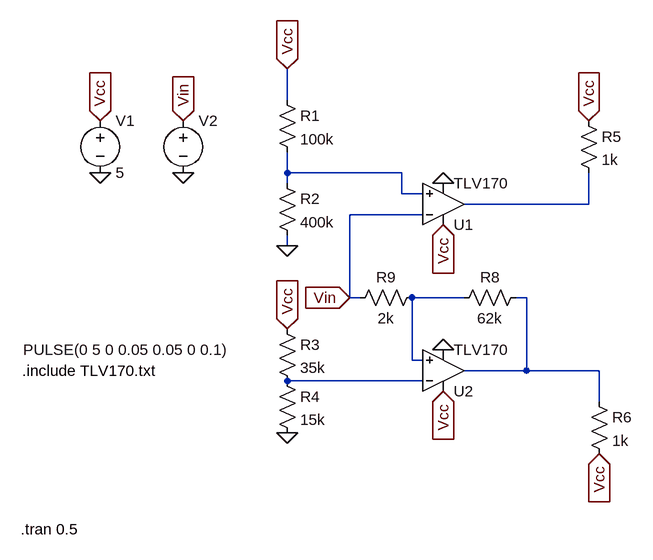
[diagram p0: schematic Draft9.asc]
Draft9.asc, the LTspice schematic file:
Version 4
SHEET 1 880 680
WIRE -96 -32 -96 -80
WIRE -96 80 -96 48
WIRE 80 80 -96 80
WIRE -96 96 -96 80
WIRE 80 112 80 80
WIRE 112 112 80 112
WIRE 368 128 368 80
WIRE 368 128 176 128
WIRE 112 144 0 144
WIRE -96 192 -96 176
WIRE 0 272 0 144
WIRE 16 272 0 272
WIRE 176 272 96 272
WIRE 272 272 256 272
WIRE 96 368 96 272
WIRE 112 368 96 368
WIRE 272 384 272 272
WIRE 272 384 176 384
WIRE 384 384 272 384
WIRE 112 400 -96 400
WIRE 384 432 384 384
FLAG -96 480 0
FLAG -96 192 0
FLAG -96 -80 Vcc
IOPIN -96 -80 In
FLAG -96 320 Vcc
IOPIN -96 320 In
FLAG 384 512 Vcc
IOPIN 384 512 In
FLAG 368 0 Vcc
IOPIN 368 0 In
FLAG 144 160 Vcc
IOPIN 144 160 In
FLAG 144 416 Vcc
IOPIN 144 416 In
FLAG 144 96 0
FLAG 144 352 0
FLAG 0 272 Vin
IOPIN 0 272 In
FLAG -384 0 Vcc
IOPIN -384 0 In
FLAG -256 0 Vin
IOPIN -256 0 In
FLAG -384 80 0
FLAG -256 80 0
SYMBOL Opamps\\opamp2 144 192 M180
SYMATTR InstName U1
SYMATTR Value TLV170
SYMBOL Opamps\\opamp2 144 448 M180
SYMATTR InstName U2
SYMATTR Value TLV170
SYMBOL res -112 -48 R0
SYMATTR InstName R1
SYMATTR Value 100k
SYMBOL res -112 80 R0
SYMATTR InstName R2
SYMATTR Value 400k
SYMBOL res -112 304 R0
SYMATTR InstName R3
SYMATTR Value 35k
SYMBOL res -112 384 R0
SYMATTR InstName R4
SYMATTR Value 15k
SYMBOL res 352 -16 R0
SYMATTR InstName R5
SYMATTR Value 1k
SYMBOL res 368 416 R0
SYMATTR InstName R6
SYMATTR Value 1k
SYMBOL res 272 256 R90
WINDOW 0 0 56 VBottom 2
WINDOW 3 32 56 VTop 2
SYMATTR InstName R8
SYMATTR Value 62k
SYMBOL res 112 256 R90
WINDOW 0 0 56 VBottom 2
WINDOW 3 32 56 VTop 2
SYMATTR InstName R9
SYMATTR Value 2k
SYMBOL voltage -384 -16 R0
WINDOW 123 0 0 Left 2
WINDOW 39 0 0 Left 2
SYMATTR InstName V1
SYMATTR Value 5
SYMBOL voltage -256 -16 R0
WINDOW 3 -246 368 Left 2
WINDOW 123 0 0 Left 2
WINDOW 39 0 0 Left 2
SYMATTR InstName V2
SYMATTR Value PULSE(0 5 0 0.05 0.05 0 0.1)
TEXT -504 384 Left 2 !.include TLV170.txt
TEXT -506 628 Left 2 !.tran 0.5

The netlist it stands for:
* Draft9.asc
XU1 N001 Vin Vcc 0 N002 TLV170  ; pins In+ In- V+ V- OUT
XU2 N003 N005 Vcc 0 N004 TLV170  ; pins In+ In- V+ V- OUT
R1 Vcc N001 100k
R2 N001 0 400k
R3 Vcc N005 35k
R4 N005 0 15k
R5 Vcc N002 1k
R6 N004 Vcc 1k
R8 N004 N003 62k
R9 N003 Vin 2k
V1 Vcc 0 5
V2 Vin 0 PULSE(0 5 0 0.05 0.05 0 0.1)
.include TLV170.txt
.tran 0.5
.backanno
.end